# Altium schematic sheet pixracer_serials.SchDoc
size A4; SheetNumber: 4; SheetTotal: 5
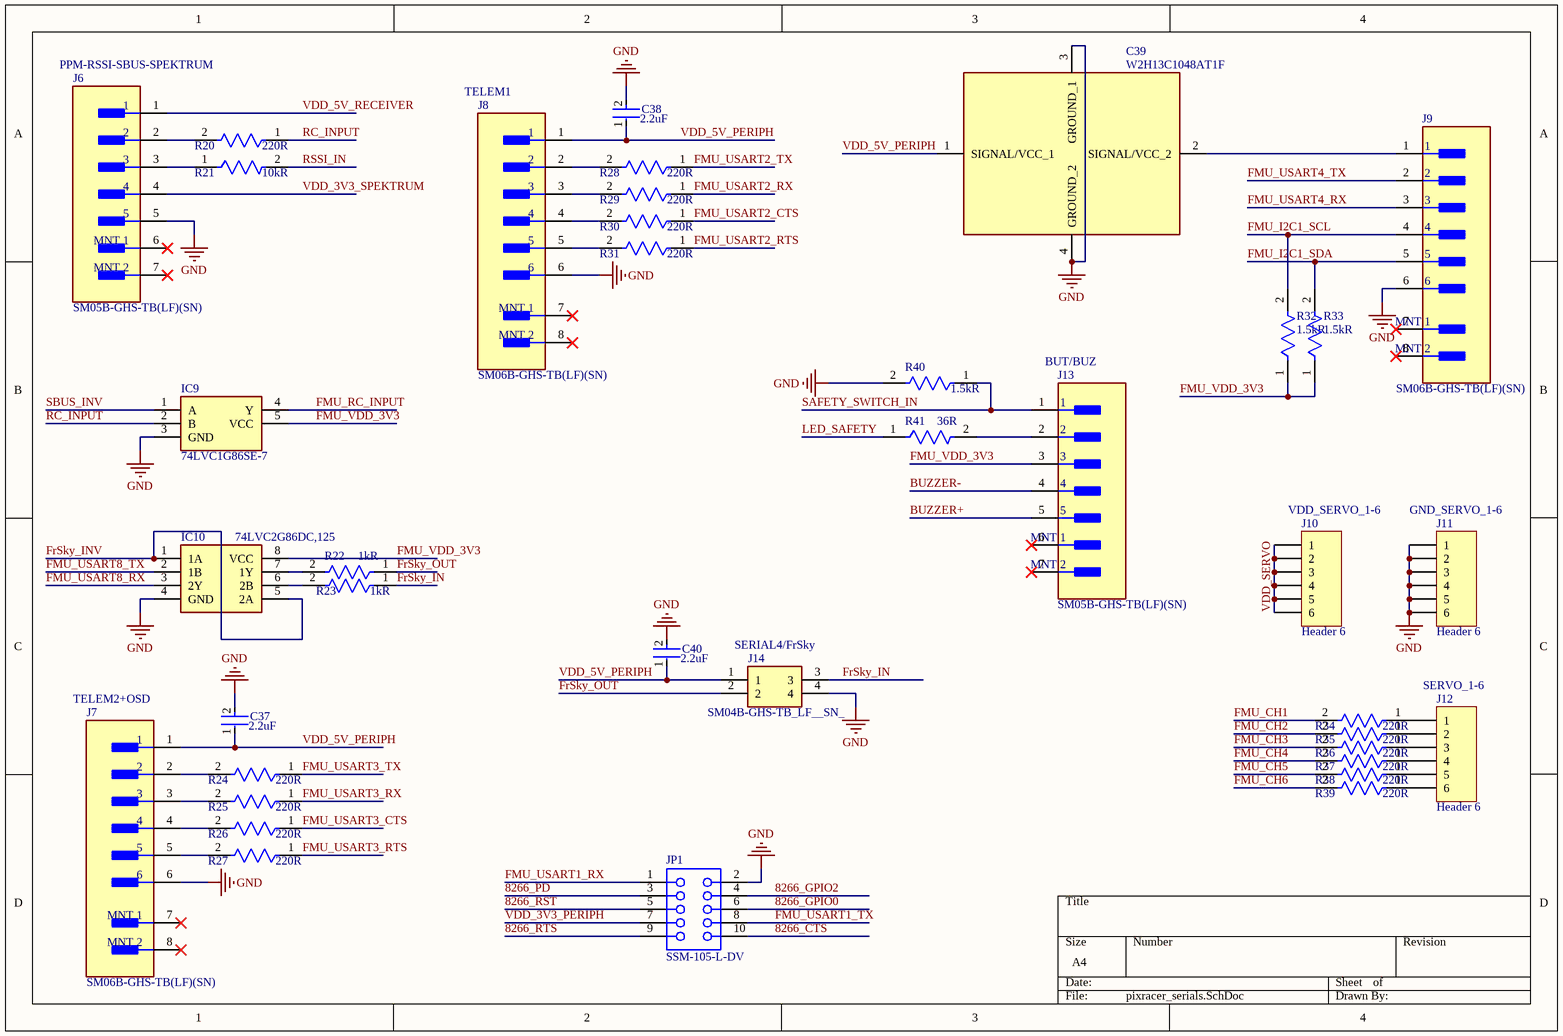
[diagram p0: pixracer_serials.SchDoc]

## Parts
C37  Capacitance: 2.2uF  [FP-C1608-080-0_1-MFG]  (hidden comment: C1608X7R1A225K080AC)
C38  Capacitance: 2.2uF  [FP-C1608-080-0_1-MFG]  (hidden comment: C1608X7R1A225K080AC)
C39  W2H13C1048AT1F  [W2H13C1048AT1A]
C40  Capacitance: 2.2uF  [FP-C1608-080-0_1-MFG]  (hidden comment: C1608X7R1A225K080AC)
IC9  74LVC1G86SE-7  [SOT65P210X110-5N]
IC10  74LVC2G86DC,125  [SOP50P310X100-8N]
J6  SM05B-GHS-TB(LF)(SN)  [FP-SM05B-GHS-TB_LF_SN-MFG]
J7  SM06B-GHS-TB(LF)(SN)  [FP-SM06B-GHS-TB_LF_SN-MFG]
J8  SM06B-GHS-TB(LF)(SN)  [FP-SM06B-GHS-TB_LF_SN-MFG]
J9  SM06B-GHS-TB(LF)(SN)  [FP-SM06B-GHS-TB_LF_SN-MFG]
J10  Header 6  [HDR1X6]
J11  Header 6  [HDR1X6]
J12  Header 6  [HDR1X6]
J13  SM05B-GHS-TB(LF)(SN)  [FP-SM05B-GHS-TB_LF_SN-MFG]
J14  SM04B-GHS-TB_LF__SN_  [SM04B-GHS-TB]
JP1  SSM-105-L-DV  [SMTC-SSM-105-X-DV]
R20  Resistance: 220R  [FP-CRCW0603-e3-MFG]  (hidden comment: CRCW0603220RFKEB)
R21  Resistance: 10kR  [FP-ERJ3G-IPC_C]  (hidden comment: ERJ-3GEYJ103V)
R22  Resistance: 1kR  [FP-RC1608-IPC_A]  (hidden comment: RC1608J102CS)
R23  Resistance: 1kR  [FP-RC1608-IPC_A]  (hidden comment: RC1608J102CS)
R24  Resistance: 220R  [FP-CRCW0603-e3-MFG]  (hidden comment: CRCW0603220RFKEB)
R25  Resistance: 220R  [FP-CRCW0603-e3-MFG]  (hidden comment: CRCW0603220RFKEB)
R26  Resistance: 220R  [FP-CRCW0603-e3-MFG]  (hidden comment: CRCW0603220RFKEB)
R27  Resistance: 220R  [FP-CRCW0603-e3-MFG]  (hidden comment: CRCW0603220RFKEB)
R28  Resistance: 220R  [FP-CRCW0603-e3-MFG]  (hidden comment: CRCW0603220RFKEB)
R29  Resistance: 220R  [FP-CRCW0603-e3-MFG]  (hidden comment: CRCW0603220RFKEB)
R30  Resistance: 220R  [FP-CRCW0603-e3-MFG]  (hidden comment: CRCW0603220RFKEB)
R31  Resistance: 220R  [FP-CRCW0603-e3-MFG]  (hidden comment: CRCW0603220RFKEB)
R32  value 1.5kR  [FP-CPF0603-MFG]  (hidden comment: CPF0603B1K5E1)
R33  value 1.5kR  [FP-CPF0603-MFG]  (hidden comment: CPF0603B1K5E1)
R34  Resistance: 220R  [FP-CRCW0603-e3-MFG]  (hidden comment: CRCW0603220RFKEB)
R35  Resistance: 220R  [FP-CRCW0603-e3-MFG]  (hidden comment: CRCW0603220RFKEB)
R36  Resistance: 220R  [FP-CRCW0603-e3-MFG]  (hidden comment: CRCW0603220RFKEB)
R37  Resistance: 220R  [FP-CRCW0603-e3-MFG]  (hidden comment: CRCW0603220RFKEB)
R38  Resistance: 220R  [FP-CRCW0603-e3-MFG]  (hidden comment: CRCW0603220RFKEB)
R39  Resistance: 220R  [FP-CRCW0603-e3-MFG]  (hidden comment: CRCW0603220RFKEB)
R40  Resistance: 1.5kR  [FP-MCR03-IPC_A]  (hidden comment: MCR03EZPFX1501)
R41  Resistance: 36R  [FP-CRCW0603-e3-IPC_B]  (hidden comment: CRCW060336R0JNEA)

## Nets
GND: C37.2 C38.2 C39.3(GROUND_1) C39.4(GROUND_2) C40.2 IC9.3(GND) IC10.4(GND) J6.5 J7.6 J8.6 J9.6 J11.1 J11.2 J11.3 J11.4 J11.5 J11.6 J14.4 JP1.2 R40.2
8266_CTS: JP1.10
8266_GPIO0: JP1.6
8266_GPIO2: JP1.4
8266_PD: JP1.3
8266_RST: JP1.5
8266_RTS: JP1.9
BUZZER+: J13.5
BUZZER-: J13.4
FMU_CH1: R34.2
FMU_CH2: R35.2
FMU_CH3: R36.2
FMU_CH4: R37.2
FMU_CH5: R38.2
FMU_CH6: R39.2
FMU_I2C1_SCL: J9.4 R32.2
FMU_I2C1_SDA: J9.5 R33.2
FMU_RC_INPUT: IC9.4(Y)
FMU_USART1_RX: JP1.1
FMU_USART1_TX: JP1.8
FMU_USART2_CTS: R30.1
FMU_USART2_RTS: R31.1
FMU_USART2_RX: R29.1
FMU_USART2_TX: R28.1
FMU_USART3_CTS: R26.1
FMU_USART3_RTS: R27.1
FMU_USART3_RX: R25.1
FMU_USART3_TX: R24.1
FMU_USART4_RX: J9.3
FMU_USART4_TX: J9.2
FMU_USART8_RX: IC10.3(2Y)
FMU_USART8_TX: IC10.2(1B)
FMU_VDD_3V3: IC9.5(VCC) IC10.8(VCC) J13.3 R32.1 R33.1
FrSky_IN: J14.3 R23.1
FrSky_INV: IC10.1(1A) IC10.5(2A)
FrSky_OUT: J14.2 R22.1
LED_SAFETY: R41.1
RC_INPUT: IC9.2(B) R20.1
RSSI_IN: R21.2
SAFETY_SWITCH_IN: J13.1 R40.1
SBUS_INV: IC9.1(A)
VDD_3V3_PERIPH: JP1.7
VDD_3V3_SPEKTRUM: J6.4
VDD_5V_PERIPH: C37.1 C38.1 C39.1(SIGNAL/VCC_1) C40.1 J7.1 J8.1 J14.1
VDD_5V_RECEIVER: J6.1
VDD_SERVO: J10.1 J10.2 J10.3 J10.4 J10.5 J10.6
NetC39_2: C39.2(SIGNAL/VCC_2) J9.1
NetIC10_6: IC10.6(2B) R23.2
NetIC10_7: IC10.7(1Y) R22.2
NetJ6_2: J6.2 R20.2
NetJ6_3: J6.3 R21.1
NetJ7_2: J7.2 R24.2
NetJ7_3: J7.3 R25.2
NetJ7_4: J7.4 R26.2
NetJ7_5: J7.5 R27.2
NetJ8_2: J8.2 R28.2
NetJ8_3: J8.3 R29.2
NetJ8_4: J8.4 R30.2
NetJ8_5: J8.5 R31.2
NetJ12_1: J12.1 R34.1
NetJ12_2: J12.2 R35.1
NetJ12_3: J12.3 R36.1
NetJ12_4: J12.4 R37.1
NetJ12_5: J12.5 R38.1
NetJ12_6: J12.6 R39.1
NetJ13_2: J13.2 R41.2

Not connected (* = marked no-connect by the designer): J6 6(MNT_1)* 7(MNT_2)*; J7 7(MNT_1)* 8(MNT_2)*; J8 7(MNT_1)* 8(MNT_2)*; J9 7(MNT_1)* 8(MNT_2)*; J13 6(MNT_1)* 7(MNT_2)*

## Notes on the sheet
- (near J6) PPM-RSSI-SBUS-SPEKTRUM
- TELEM1
- (near J13) BUT/BUZ
- (near J10) VDD_SERVO_1-6
- (near J11) GND_SERVO_1-6
- (near J14) SERIAL4/FrSky
- (near J7) TELEM2+OSD
- (near J12) SERVO_1-6

## Library data of the parts
C37 C38 C40 = CMP-08246-006835-1: Multilayer Ceramic Capacitors 2.2μF ±10% 10V X7R SMD 0603; Lead Free: Lead Free; Mount: Surface Mount; Case Code (Metric): 1608; Construction: Flat; Packaging: Tape and Reel; REACH SVHC: No SVHC; Weight: 7.1E-05oz; Resistor Type: Ceramic; Package Quantity: 4000; Voltage Rating (DC): 10V; Case/Package: 0603; Termination: SMD/SMT; Case Code (Imperial): 0603; Series: C; Voltage Rating: 10V; Min Operating Temperature: -55°C; Dielectric Material: Ceramic; Length: 1.6mm; Tolerance: 10%; Depth: 0.8mm; Width: 0.031inch; Dielectric: X7R; Max Operating Temperature: 125°C; RoHS Compliant: Yes; Height: 0.8mm; Thickness: 0.037inch
C39 = W2H13C1048AT1F: Capacitor; Manufacturer_Name: AVX; Datasheet Link: https://componentsearchengine.com/Datasheets/1/W2H13C1048AT1F.pdf; Height: 1mm; Manufacturer_Part_Number: W2H13C1048AT1F; Mouser Part Number: 581-W2H13C1048AT1F; Mouser Price/Stock: https://www.mouser.com/Search/Refine.aspx?Keyword=581-W2H13C1048AT1F; Arrow Part Number: W2H13C1048AT1F; Arrow Price/Stock: https://www.arrow.com/en/products/w2h13c1048at1f/avx
IC9 = 74LVC1G86SE-7: Integrated Circuit; Manufacturer_Name: Diodes Inc.; Datasheet Link: https://www.diodes.com/assets/Datasheets/74LVC1G86.pdf; Height: 1.1mm; Manufacturer_Part_Number: 74LVC1G86SE-7; Mouser Part Number: 621-74LVC1G86SE-7; Mouser Price/Stock: https://www.mouser.co.uk/ProductDetail/Diodes-Incorporated/74LVC1G86SE-7/?qs=8Dv1RiiPiVJ%252BnYSWg3kTgg%3D%3D; Arrow Part Number: 74LVC1G86SE-7; Arrow Price/Stock: https://www.arrow.com/en/products/74lvc1g86se-7/diodes-incorporated?region=nac
IC10 = 74LVC2G86DC,125: Integrated Circuit; Manufacturer_Name: Nexperia; Datasheet Link: https://assets.nexperia.com/documents/data-sheet/74LVC2G86.pdf; Height: 1mm; Manufacturer_Part_Number: 74LVC2G86DC,125; Mouser Part Number: 771-LVC2G86DC125; Mouser Price/Stock: https://www.mouser.co.uk/ProductDetail/Nexperia/74LVC2G86DC125?qs=me8TqzrmIYXbZy3sMRjHUw%3D%3D; Arrow Part Number: 74LVC2G86DC,125; Arrow Price/Stock: https://www.arrow.com/en/products/74lvc2g86dc125/nexperia?region=nac
J6 J13 = CMP-17439-000048-1: CONN HEADER SMD R/A 5POS 1.25MM; Current Rating: 1A; Pitch: 0.049inch; Connector Type: Outer Shroud Contact; Number of Positions: 5; Voltage Rating (AC): 50V; Wire/Cable Gauge: 26AWG; Series: GH; Mount: Surface Mount; Housing Material: Nylon; Contact Type: Outer Shroud Contact; REACH SVHC: No SVHC; Number of Rows: 1; Lead Free: Lead Free; Color: Natural; Contact Material: Bronze; Contact Plating: Tin; Max Operating Temperature: 85°C; Orientation: Right Angle; Number of Contacts: 5; Voltage Rating: 50V; Housing Color: Natural; Termination: Solder; Min Operating Temperature: -25°C; Fastening Type: Ramp; Packaging: Tape and Reel
J7-J9 = CMP-17439-000061-1: CONN HEADER SMD R/A 6POS 1.25MM; Number of Contacts: 6; Voltage Rating: 50V; Current Rating: 1A; Connector Type: Outer Shroud Contact; Contact Resistance: 50mR; Orientation: Right Angle; Max Operating Temperature: 85°C; Mount: Surface Mount; Packaging: Tape and Reel; Contact Plating: Tin; Depth: 4.05mm; Max Voltage Rating (AC): 50V; Lead Free: Lead Free; Pitch: 1.25mm; Number of Positions: 6; Max Current Rating: 1A; Termination: Solder; Min Operating Temperature: -25°C; Housing Color: Beige; Fastening Type: Ramp; Length: 10.75mm; Color: Natural; Contact Material: Bronze; Housing Material: Polyamide; Number of Rows: 1
J10-J12 = Header 6: Header, 6-Pin; LatestRevisionDate: 17-Jul-2002; LatestRevisionNote: Re-released for DXP Platform.; Publisher: Altium Limited
J14 = SM04B-GHS-TB_LF__SN_: Connector; Manufacturer_Name: JST (JAPAN SOLDERLESS TERMINALS); Manufacturer_Part_Number: SM04B-GHS-TB(LF)(SN); Datasheet Link: http://uk.rs-online.com/web/p/products/7521797
JP1 = CMP-1023-00207-1: Tiger Claw(TM) Surface Mount Socket, Vertical, -55 to 125 degC, 2.54 mm Pitch, 10-Pin, Female, RoHS; Manufacturer: Samtec; Pitch: 2.54 mm; PackageReference: SSM-105-X-DV; DatasheetVersion: F-214; ComponentLink2Description: Datasheet; Mounting Technology: Surface Mount; PackageDescription: .100 C.L. Double Vertical SMT Socket Strip; ComponentLink3Description: Package Specification; ComponentLink2URL: http://www.samtec.com/documents/webfiles/pdf/SSM_SM.PDF; ComponentLink1URL: http://www.samtec.com; PackageVersion: AK, 3/2000; Orientation: Vertical; RoHS: True; ComponentLink1Description: Manufacturer URL; PartNumber: SSM-105-L-DV; ComponentLink3URL: http://www.samtec.com/documents/webfiles/cpdf/SSM-1XX-XXX-DV-XX-XX-X-XX-MKT.pdf; Temperature Range: -55 to 125 degC
R20 R24-R31 R34-R39 = CMP-02407-003555-1: RES Thick Film, 220Ω, 1%, 0.1W, 100ppm/°C, 0603; Voltage Rating: 75V; Power Rating: 100mW; Length: 1.55mm; Weight: 7.1E-05oz; Package Quantity: 10000; Case/Package: 0603; Composition: Thick Film; Max Operating Temperature: 155°C; Military Standard: Not; Tolerance: 1%; Lead Free: Lead Free; Number of Terminations: 2; Min Operating Temperature: -55°C; Case Code (Imperial): 0603; Max Power Dissipation: 100mW; Features: Automotive AEC-Q200; Packaging: Tape and Reel; Temperature Coefficient: 100ppm/°C; Case Code (Metric): 1608; Termination: SMD/SMT; Depth: 0.85mm; Height: 0.02inch; Width: 0.85mm
R21 = CMP-2000-00704-2: RES SMD 10K OHM 5% 1/10W 0603; Temperature Coefficient: 200ppm/°C; Max Power Dissipation: 100mW; Voltage Rating (DC): 50V; Voltage Rating: 75V; Resistor Type: Thick Film; Tolerance: 5%; Military Standard: Not; Package Quantity: 1; Max Operating Temperature: 155°C; Mount: Surface Mount; Technology: THICK FILM; Case/Package: 0603; Construction: Rectangular; Depth: 0.8mm; Case Code (Imperial): 0603; Weight: 7.1E-05oz; Features: Automotive AEC-Q200; Packaging: Tape and Reel; Width: 0.8mm; Length: 1.6mm; Termination: SMD/SMT; Power Rating: 100mW; Lead Free: Lead Free; Number of Terminations: 2; Height: 0.45mm; RoHS Compliant: Yes; Min Operating Temperature: -55°C; Contact Plating: Tin; REACH SVHC: No SVHC; Resistance Tolerance: 5%; Series: ERJ; Working Voltage: 75V; Case Code (Metric): 1608
R22 R23 = CMP-13261-002301-1: Res Thick Film 0603 1kΩ 5% 0.1W ±100ppm/°C Molded SMD T/R; Power Rating: 100mW; Voltage Rating (DC): 50V; Contact Plating: Tin; Mount: Surface Mount; Number of Terminations: 2; Features: Moisture Resistant; Max Power Dissipation: 100mW; Military Standard: Not; Case/Package: 0603; Radiation Hardening: No; Temperature Coefficient: 100ppm/°C; Length: 1.6mm; Height: 0.022inch; Case Code (Metric): 1608; Max Operating Temperature: 155°C; Composition: Thick Film; Tolerance: 5%; Width: 0.031inch; Depth: 0.8mm; Packaging: Tape and Reel; Lead Free: Lead Free; Case Code (Imperial): 0603; Min Operating Temperature: -55°C
R32 R33 = CMP-03211-005433-1: RES SMD 1.5KΩ 0.1% 1/16W 0603; Manufacturer: TE Connectivity; Power Rating: 0.063W; Voltage Rating: 50V; Temperature Coefficient: 25ppm/°C; Series: CPF; Temperature Range Low: -55°C; ComponentLink2URL: https://www.te.com/commerce/DocumentDelivery/DDEController?Action=showdoc&DocId=Data+Sheet%7F1773200%7FM%7Fpdf%7FEnglish%7FENG_DS_1773200_M.pdf%7F3-1676481-2; Height: 0.55mm; Lead Free: Yes; Resistance: 1.5KΩ; RoHS: TRUE; Device Class L1: Passive Components; Manufacturer Part Number: CPF0603B1K5E1; Octopart: https://octopart.com/cpf0603b1k5e1-te+connectivity-9539421; Package: CPF0603; Device Class L3: Chip SMD Resistors; packaging: 1k Reel; Tolerance: 0.1%; octopart_url: https://octopart.com/cpf0603b1k5e1-te+connectivity-9539421; Temperature: -55°C to +155°C; Automotive: No; Device Class L2: Resistors; Composition: Thin Film; Ipc Land Pattern Name: RESC15580X45; ComponentLink2Description: Datasheet; Category: Res; Temperature Range High: +155°C
R40 = CMP-08839-007837-1: Thick Film Chip Resistor, 0603, 1.5kΩ, 1%, 100ppm/°C, 0.1W, 50V; Max Power Dissipation: 100mW; Package Quantity: 5000; Case/Package: 0603; Max Operating Temperature: 155°C; Power Rating: 100mW; Voltage Rating (DC): 50V; Features: Automotive AEC-Q200; Mount: Surface Mount; Min Operating Temperature: -55°C; Military Standard: Not; Depth: 0.8mm; Case Code (Imperial): 0603; Number of Terminations: 2; Tolerance: 1%; Width: 0.031inch; Lead Free: Lead Free; Case Code (Metric): 1608; Temperature Coefficient: 100ppm/°C; Resistor Type: Thick Film; RoHS Compliant: Yes; Length: 0.063inch; Height: 0.022inch; Packaging: Tape and Reel
R41 = CMP-2000-03274-2: RES Thick Film, 36Ω, 5%, 0.1W, 200ppm/°C, 0603; Power Rating: 100mW; Voltage Rating (DC): 75V; Min Operating Temperature: -55°C; Lead Free: Lead Free; Width: 0.033inch; Case Code (Metric): 1608; Max Operating Temperature: 155°C; Packaging: Tape and Reel; Temperature Coefficient: 200ppm/°C; Features: Automotive AEC-Q200; Case Code (Imperial): 0603; Case/Package: 0603; Weight: 7.1E-05oz; Composition: Thick Film; Max Power Dissipation: 100mW; Radiation Hardening: No; Number of Terminations: 2; Height: 0.02inch; Package Quantity: 1; Contact Plating: Tin; Voltage Rating: 75V; Length: 0.061inch; Tolerance: 5%